# Altium project Boost_PFC.PrjPCB
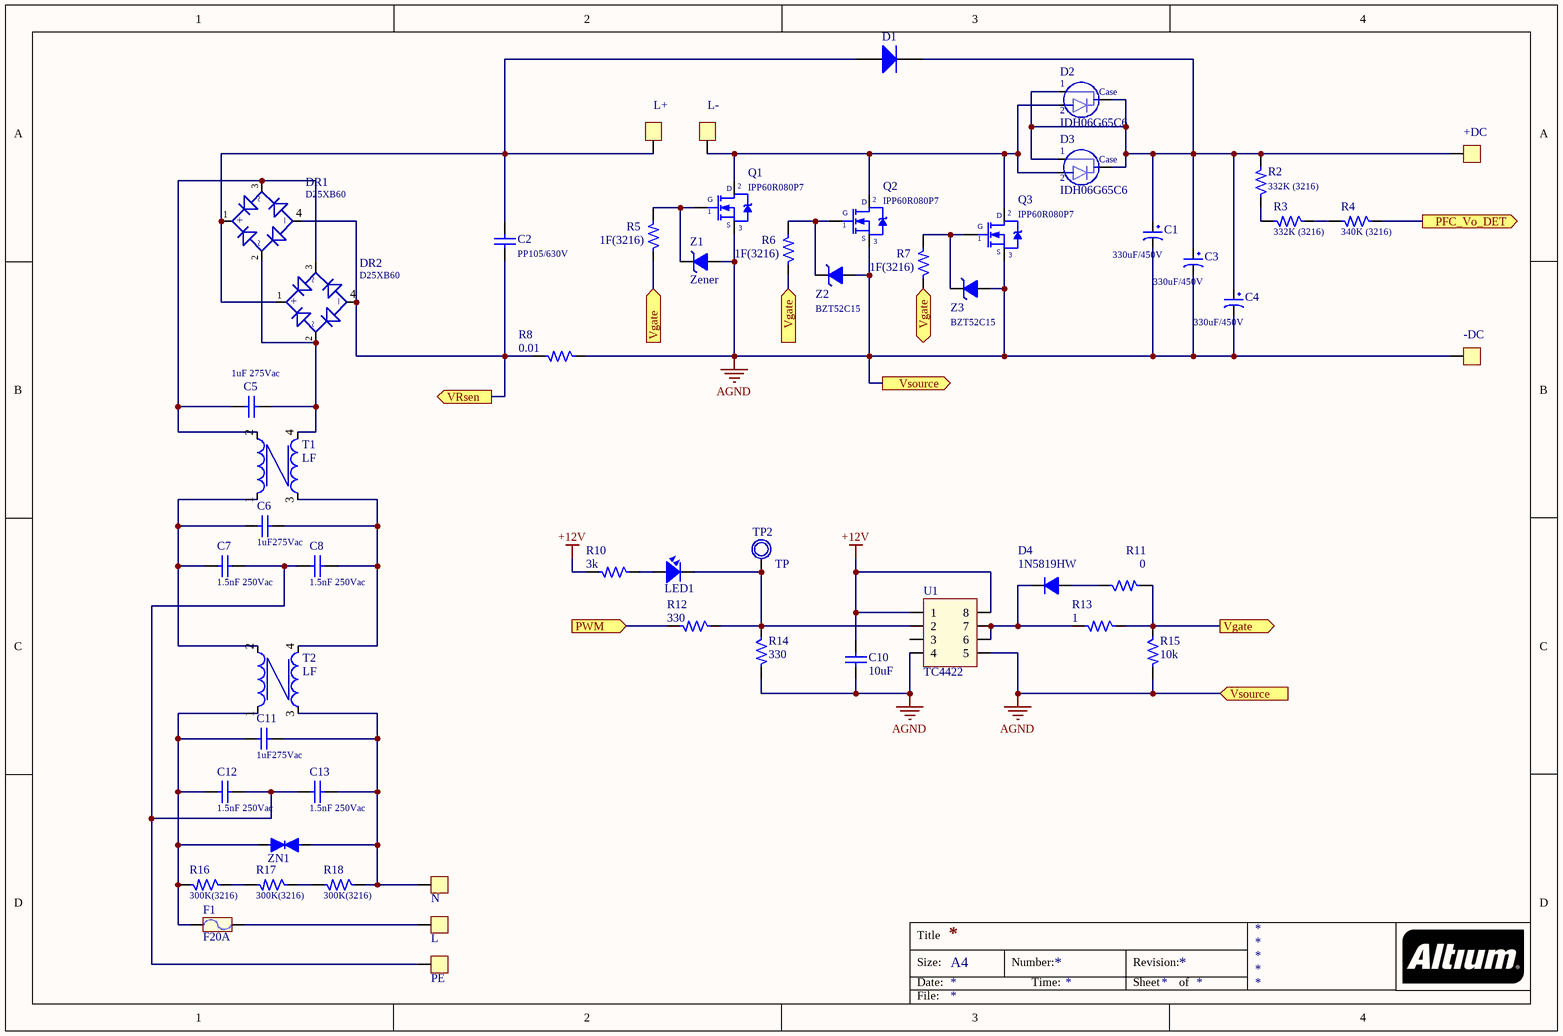
[diagram p0: Sheet1.SchDoc]
2 sheets, 85 parts. Net scope: flat (ports and power ports of the same name join across sheets).
Board file: PCB1.PcbDoc
Sheets:
  Sheet1.SchDoc
  Sheet3.SchDoc

## Sheet Sheet1.SchDoc
size A4

### Parts
+DC  ERNI  [Connector]  (value not drawn)
-DC  ERNI  [Connector]  (value not drawn)
C1  330uF/450V  [Capacitor]
C2  PP105/630V  [C1uF 28mm]
C3  330uF/450V  [Capacitor]
C4  330uF/450V  [Capacitor]
C5  1uF 275Vac  [CAP 11x22]
C6  1uF275Vac  [CAP 11x22]
C7  1.5nF 250Vac  [CN4]
C8  1.5nF 250Vac  [CN4]
C10  10uF  [SM-CAP-0805]
C11  1uF275Vac  [CAP 11x22]
C12  1.5nF 250Vac  [CN4]
C13  1.5nF 250Vac  [CN4]
D1  Diode  [D5AN]  (value not drawn)
D2  IDH06G65C6  [TO-263 Diode]
D3  IDH06G65C6  [TO-263 Diode]
D4  1N5819HW  [BZT52C15]
DR1  D25XB60  [D25XB60]
DR2  D25XB60  [D25XB60]
F1  F20A  [Fuse]
L  ERNI  [Connector]  (value not drawn)
L+  ERNI  [Connector]  (value not drawn)
L-  ERNI  [Connector]  (value not drawn)
LED1  LED  [SM-LED-0805-Blue]  (value not drawn)
N  ERNI  [Connector]  (value not drawn)
PE  ERNI  [Connector]  (value not drawn)
Q1  IPP60R080P7  [TO-263 MOSFET]
Q2  IPP60R080P7  [TO-263 MOSFET]
Q3  IPP60R080P7  [TO-263 MOSFET]
R2  332K (3216)  [SM-RES-1206]
R3  332K (3216)  [SM-RES-1206]
R4  340K (3216)  [SM-RES-1206]
R5  1F(3216)  [SM-RES-1206]
R6  1F(3216)  [SM-RES-1206]
R7  1F(3216)  [SM-RES-1206]
R8  0.01  [WSHM2818]
R10  3k  [SM-RES-0805]
R11  0  [SM-RES-1206]
R12  330  [SM-RES-0805]
R13  1  [SM-RES-1206]
R14  330  [SM-RES-0805]
R15  10k  [SM-RES-0805]
R16  300K(3216)  [SM-RES-1206]
R17  300K(3216)  [SM-RES-1206]
R18  300K(3216)  [SM-RES-1206]
T1  LF  [EMI tranformer]
T2  LF  [EMI tranformer]
TP2  TP  [TP1]
U1  TC4422  [TC4422]
Z1  Zener  [BZT52C15]
Z2  BZT52C15  [BZT52C15]
Z3  BZT52C15  [BZT52C15]
ZN1  Z  [RT 7mm]  (value not drawn)

### Ports
PFC_Vo_DET (out), PWM (in), Vgate (in), Vgate (out), VRsen (out), Vsource (in), Vsource (out)

### Nets
+12V: C10.1 R10.2 U1.1 U1.8
AGND: -DC.0 C1.2 C3.2 C4.2 C10.2 Q1.3(S) Q2.3(S) Q3.3(S) R8.1 R14.2 R15.2 U1.4 U1.5 Z1.1(A) Z2.1(A) Z3.1(A) ; port Vsource
Net+DC_0: +DC.0 C1.1 C3.1 C4.1 D1.2(K) D2.1(Kathod) D3.1(Kathod) R2.2
NetC2_1: C2.1 DR1.4 DR2.4 R8.2 ; port VRsen
NetC2_2: C2.2 D1.1(A) DR1.1 DR2.1 L+.0
NetC5_1: C5.1 DR1.2 DR2.2 T1.4
NetC5_2: C5.2 DR1.3 DR2.3 T1.2
NetC6_1: C6.1 C7.2 T1.1 T2.2
NetC6_2: C6.2 C8.1 T1.3 T2.4
NetC7_1: C7.1 C8.2 C12.1 C13.2 PE.0
NetC11_1: C11.1 C13.1 N.0 R18.1 T2.3 ZN1.2
NetC11_2: C11.2 C12.2 F1.2 R16.2 T2.1 ZN1.1
NetC20_2: R4.1 ; port PFC_Vo_DET
NetD2_2: D2.2(Anode) D3.2(Anode) L-.0 Q1.2(D) Q2.2(D) Q3.2(D)
NetD4_1: D4.1(A) R11.1
NetD4_2: D4.2(K) R13.2 U1.6 U1.7
NetF1_1: F1.1 L.0
NetLED1_1: LED1.1 R10.1
NetLED1_2: LED1.2 R12.1 R14.1 TP2.1 U1.2
NetQ1_1: Q1.1(G) R5.2 Z1.2(K)
NetQ2_1: Q2.1(G) R6.2 Z2.2(K)
NetQ3_1: Q3.1(G) R7.2 Z3.2(K)
NetR2_1: R2.1 R3.2
NetR3_1: R3.1 R4.2
NetR5_1: R5.1 R6.1 R7.1 R11.2 R13.1 R15.1 ; port Vgate
NetR12_2: R12.2 ; port PWM
NetR16_1: R16.1 R17.2
NetR17_1: R17.1 R18.2

Not connected (* = marked no-connect by the designer): U1 3

### Notes on the sheet
- Title
- Size:
- Date:
- A4
- Number:
- Time:
- Revision:
- Sheet
- of
- File:
- (in symbol Bridge Rectifier) ~; +; _

### Library data of the parts
+DC -DC L L+ L- N PE = Connector
C1 C3 C4 = CP9: Cap 10000uF/63V; Value: 220uF/450V
C2 C5-C8 C10-C13 = Cap Semi_3: Capacitor (Semiconductor SIM Model); Value: 104; LatestRevisionDate: 17-Jul-2002; LatestRevisionNote: Re-released for DXP Platform.; PackageReference: C1206; Publisher: Altium Limited
D1 = Diode: Default Diode; Code - JEDEC: DO-214-AB; Value: 1N5007; Published: 8-Jun-2000; Revision: July-2002: Re-released for DXP Platform.; Publisher: Altium Limited
D2 D3 = CSD06060
D4 = D0.5A: Value: 1N4148
DR1 DR2 = Bridge Rectifier
F1 = Fuse: Designed by: VanDungEvn; Value: Fuse
LED1 = LED: LED Single colour Green and Red; Value: LED 3 ly Single Colour
Q1-Q3 = IRF840: MOSFET N - CHANNEL 500V - 0.75 - 8A - TO-220; Value: IRF840
R2-R8 R10-R18 = R: Resistor 1/4W; Value: R1/4W - 1K
T1 T2 = IEMI filter
TP2 = TP1: Test Point; Value: Test Point
U1 = DIP8: Value: DIP8
Z2 Z3 = Zener
ZN1 = ZN: Zenner Protect AC in; Value: Zenner Protect AC input

## Sheet Sheet3.SchDoc
size A
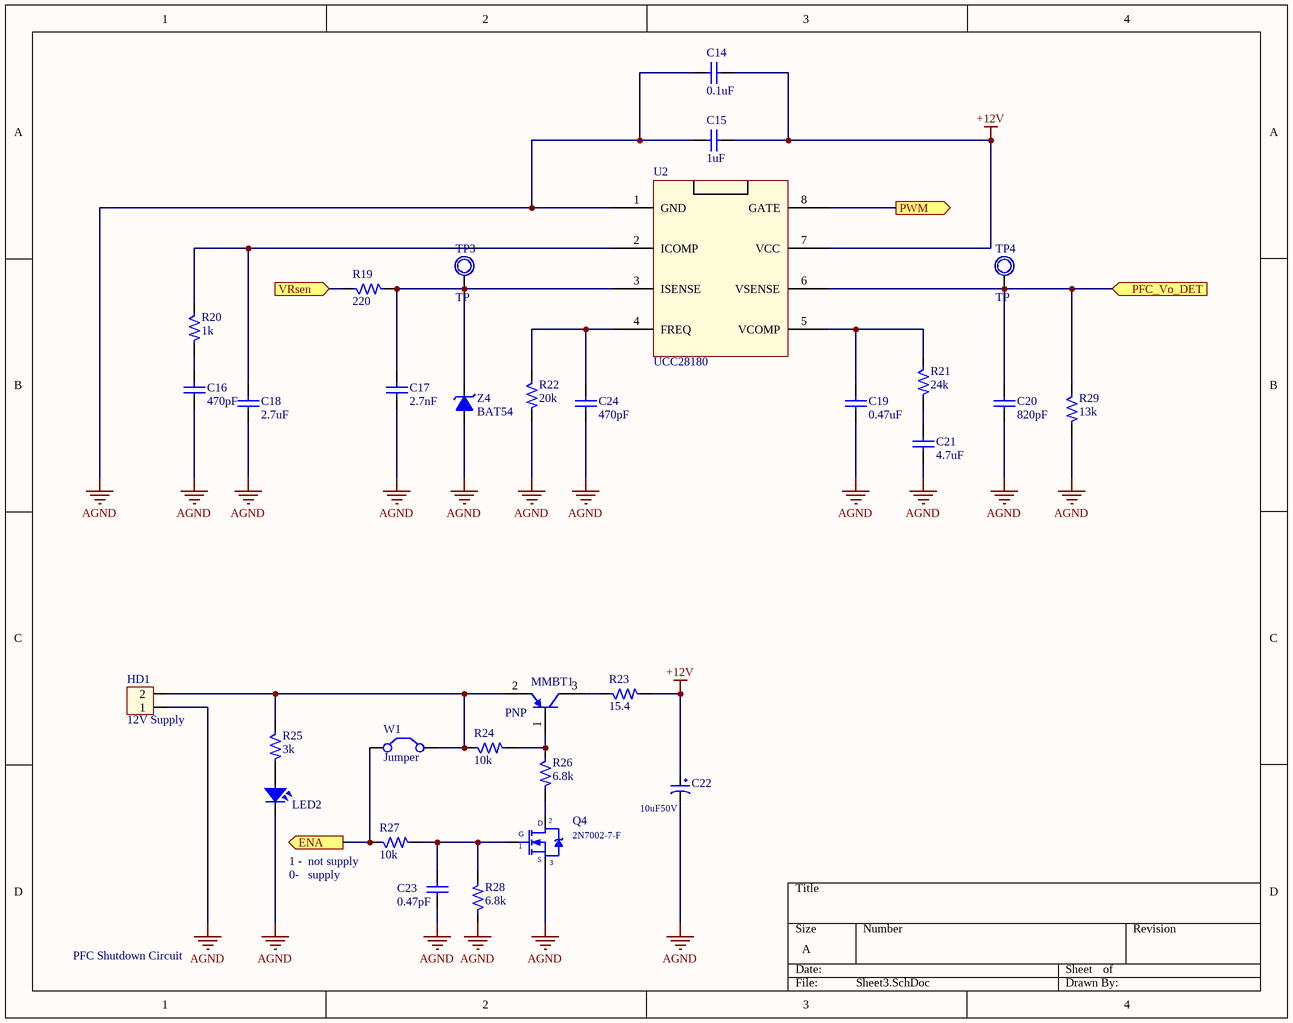
[diagram p1: Sheet3.SchDoc]

### Parts
C14  0.1uF  [SM-CAP-0805]
C15  1uF  [Cap 3228]
C16  470pF  [SM-CAP-0805]
C17  2.7nF  [SM-CAP-0805]
C18  2.7uF  [SM-CAP-0805]
C19  0.47uF  [SM-CAP-0805]
C20  820pF  [SM-CAP-0805]
C21  4.7uF  [SM-CAP-0805]
C22  10uF50V  [CAP-ALU-SMD-4.5x5x1.4]
C23  0.47pF  [SM-CAP-0805]
C24  470pF  [SM-CAP-0805]
HD1  12V Supply  [HED2]
LED2  LED  [SM-LED-0805-Green]  (value not drawn)
MMBT1  PNP  [SOT_23_P_transistor]
Q4  2N7002-7-F  [SOT_23_Mosfet]
R19  220  [SM-RES-0805]
R20  1k  [SM-RES-0805]
R21  24k  [SM-RES-0805]
R22  20k  [SM-RES-0805]
R23  15.4  [SM-RES-1206]
R24  10k  [SM-RES-0805]
R25  3k  [SM-RES-0805]
R26  6.8k  [SM-RES-0805]
R27  10k  [SM-RES-0805]
R28  6.8k  [SM-RES-0805]
R29  13k  [SM-RES-1206]
TP3  TP  [TP1]
TP4  TP  [TP1]
U2  UCC28180  [UCC28180]
W1  Jumper  [JP2]
Z4  BAT54  [BZT52C15]

### Ports
ENA (out), PFC_Vo_DET (in), PWM (out), VRsen (in)

### Nets
+12V: C14.1 C15.1 C22.1 R23.2 U2.7(VCC)
AGND: C14.2 C15.2 C16.1 C17.1 C18.1 C19.1 C20.1 C21.1 C22.2 C23.1 C24.1 HD1.1 LED2.2 Q4.1(G) R22.2 R28.1 R29.2 U2.1(GND) Z4.1(A)
NetC2_1: R19.1 ; port VRsen
NetC16_2: C16.2 R20.2
NetC17_2: C17.2 R19.2 TP3.1 U2.3(ISENSE) Z4.2(K)
NetC18_2: C18.2 R20.1 U2.2(ICOMP)
NetC19_2: C19.2 R21.1 U2.5(VCOMP)
NetC20_2: C20.2 R29.1 TP4.1 U2.6(VSENSE) ; port PFC_Vo_DET
NetC21_2: C21.2 R21.2
NetC23_2: C23.2 Q4.2(D) R27.2 R28.2
NetC24_2: C24.2 R22.1 U2.4(FREQ)
NetHD1_2: HD1.2 MMBT1.2(E) R24.1 R25.1 W1.2(C2)
NetLED2_1: LED2.1 R25.2
NetMMBT1_1: MMBT1.1(B) R24.2 R26.1
NetMMBT1_3: MMBT1.3(C) R23.1
NetQ4_3: Q4.3(S) R26.2
NetR12_2: U2.8(GATE) ; port PWM
NetR27_1: R27.1 W1.1(C1) ; port ENA

### Notes on the sheet
- (near R27) 1 -  not supply
- (near R27) 0-   supply
- PFC Shutdown Circuit

### Library data of the parts
C14-C21 C23 C24 = Cap Semi_3: as C2 on sheet Sheet1; LatestRevisionDate: 17-Jul-2002; LatestRevisionNote: Re-released for DXP Platform.; PackageReference: C1206; Publisher: Altium Limited
C22 = CP9: Cap 10000uF/63V; Value: 220uF/450V
HD1 = Hed2: Header 2 (Green); Value: Header 2
LED2 = LED: as LED1 on sheet Sheet1
MMBT1 = PNP: PNP Bipolar Transistor; Published: 8-Jun-2000; LatestRevisionDate: 29-May-2009; LatestRevisionNote: IPC-7351 Footprint Added.; PackageVersion: Aug-1999; PackageReference: SOT-23B; Publisher: Altium Limited; PackageDescription: 3-Pin SOT-23 Package 0.95 mm Pitch, 2.4 mm Lead Span
Q4 = IRF840: as Q1 on sheet Sheet1
R19-R29 = R: Resistor 1/4W; Value: R1/4W - 1K
TP3 TP4 = TP1: Test Point; Value: Test Point
W1 = Jumper: Jumper Wire; Published: 24-Mar-1999; LatestRevisionDate: 17-Jul-2002; LatestRevisionNote: Re-released for DXP Platform.; PackageReference: RAD-0.2; Publisher: Altium Limited; PackageDescription: Radial Cap, Thru-Hole; 2 Leads; 0.2 in Pin Spacing
Z4 = Zener

## Nets that join several sheets
+12V: Sheet1 (C10.1 R10.2 U1.1 U1.8), Sheet3 (5 pins)
AGND: Sheet1 (16 pins), Sheet3 (19 pins)
NetC2_1: Sheet1 (C2.1 DR1.4 DR2.4 R8.2), Sheet3 (R19.1)
NetC20_2: Sheet1 (R4.1), Sheet3 (C20.2 R29.1 TP4.1 U2.6)
NetR12_2: Sheet1 (R12.2), Sheet3 (U2.8)